# EAGLE design CrawlerProc_ver_00 (EAGLE 5.09)
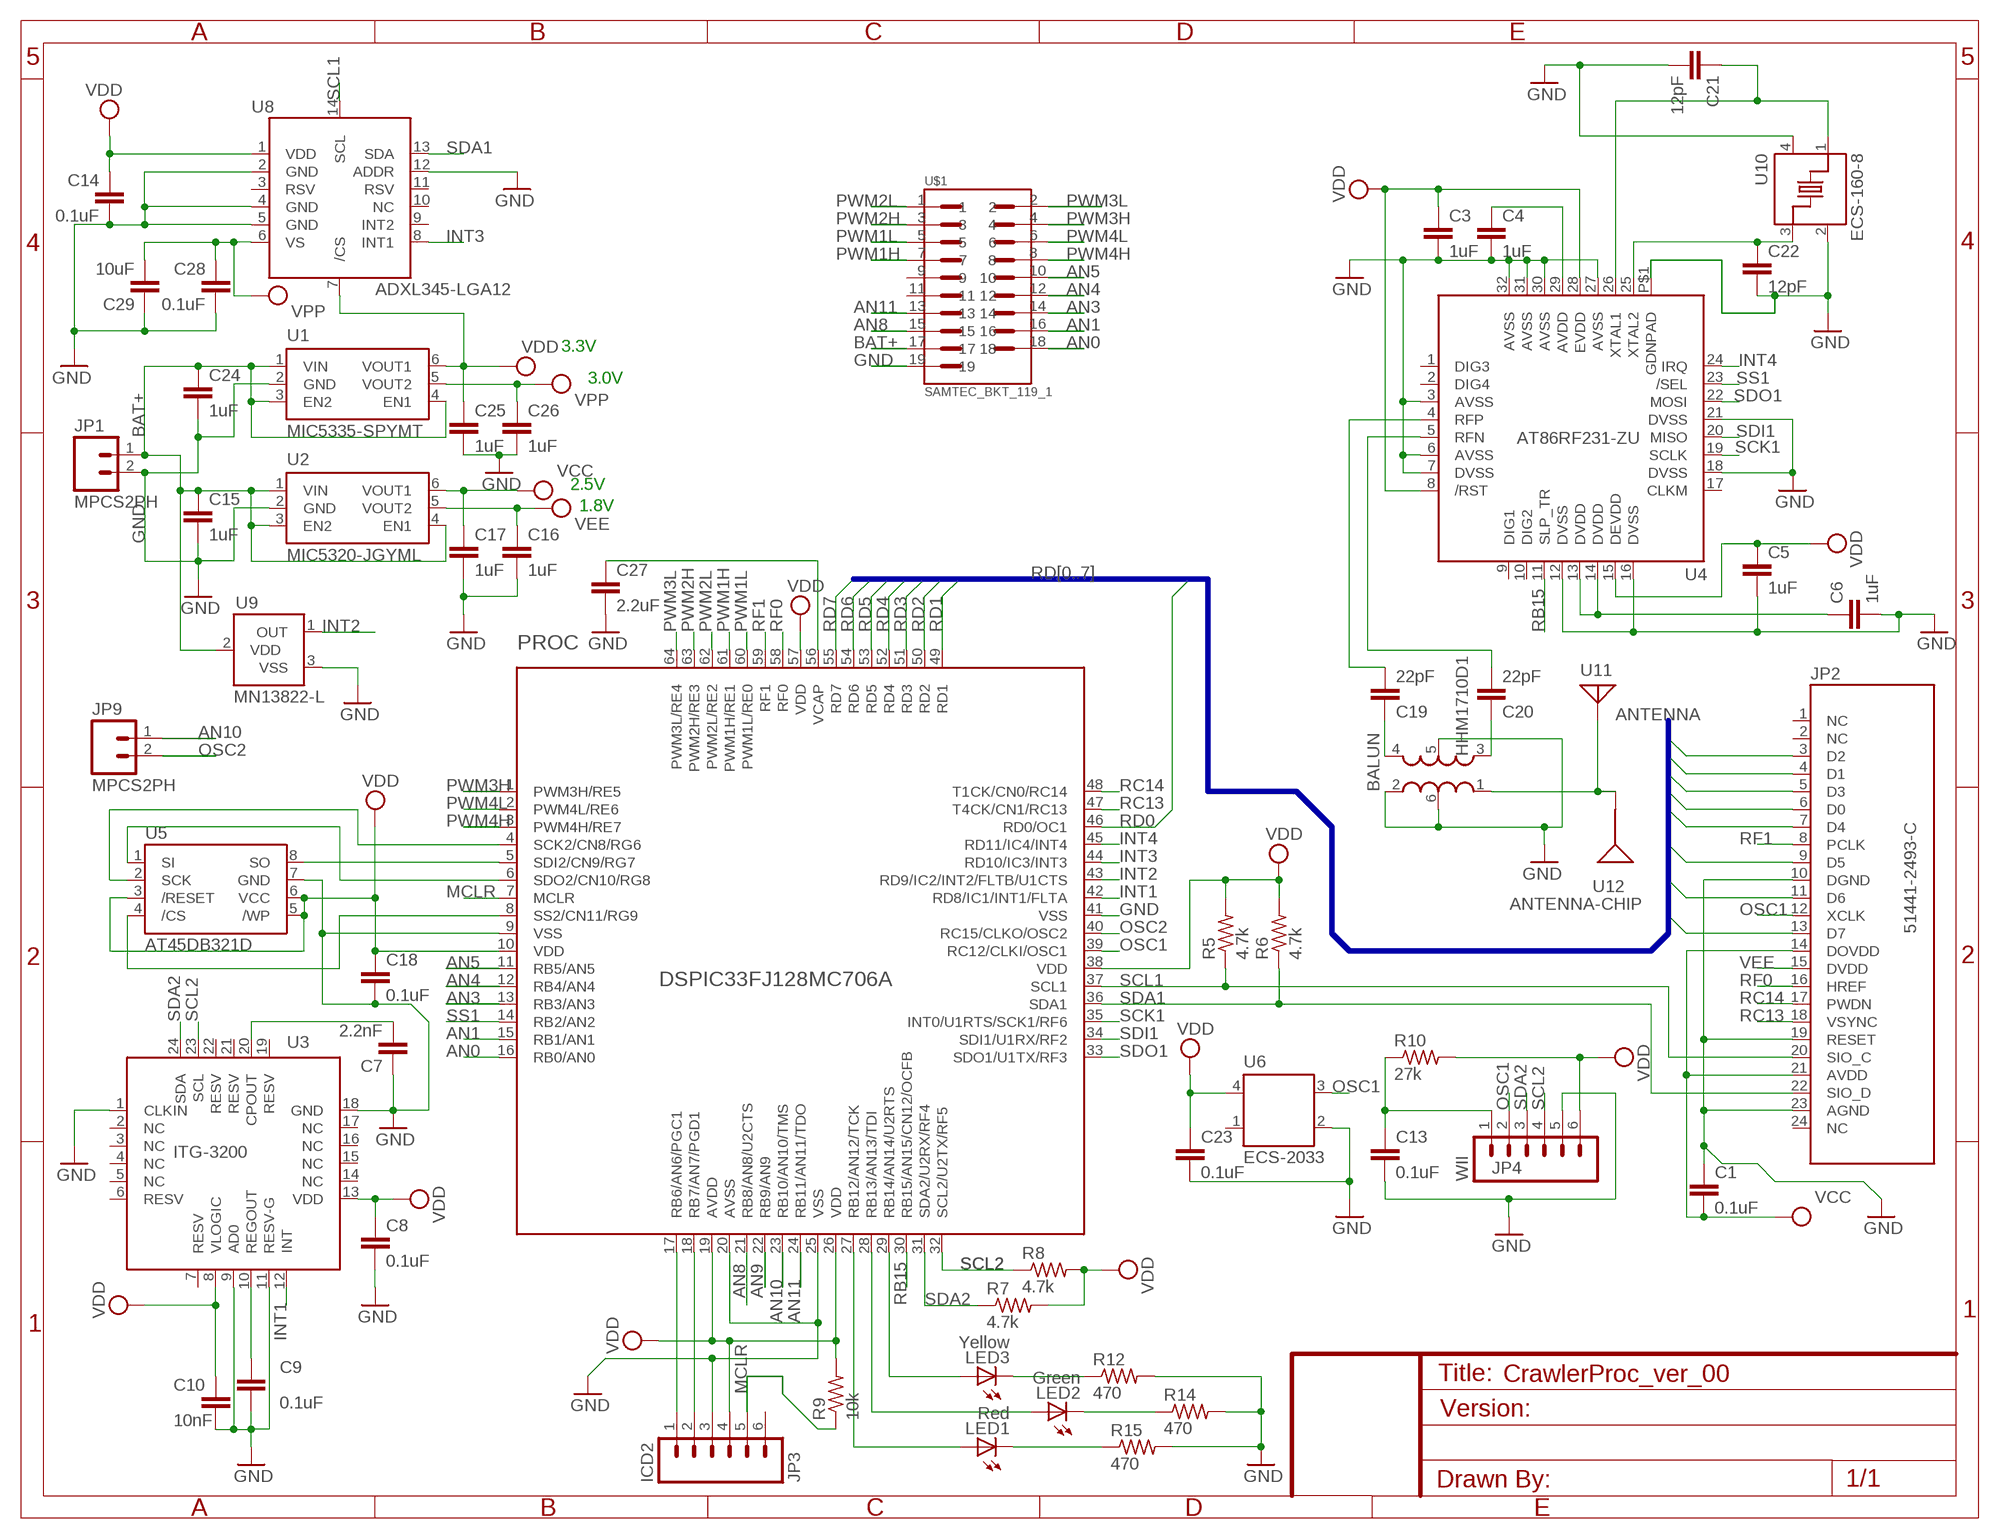
[diagram p0: schematic, sheet 1]

## Parts
BALUN  HHM1710D1  BALUNA  [BALUN]
C1  0.1uF  CAP0402-CAP  [0402-CAP]
C3  1uF  CAP0402-CAP  [0402-CAP]
C4  1uF  CAP0402-CAP  [0402-CAP]
C5  1uF  CAP0402-CAP  [0402-CAP]
C6  1uF  CAP0402-CAP  [0402-CAP]
C7  2.2nF  CAP0402-CAP  [0402-CAP]
C8  0.1uF  CAP0402-CAP  [0402-CAP]
C9  0.1uF  CAP0402-CAP  [0402-CAP]
C10  10nF  CAP0402-CAP  [0402-CAP]
C13  0.1uF  CAP0402-CAP  [0402-CAP]
C14  0.1uF  CAP0402-CAP  [0402-CAP]
C15  1uF  CAP0402-CAP  [0402-CAP]
C16  1uF  CAP0402-CAP  [0402-CAP]
C17  1uF  CAP0402-CAP  [0402-CAP]
C18  0.1uF  CAP0402-CAP  [0402-CAP]
C19  22pF  CAP0402-CAP  [0402-CAP]
C20  22pF  CAP0402-CAP  [0402-CAP]
C21  12pF  CAP0402-CAP  [0402-CAP]
C22  12pF  CAP0402-CAP  [0402-CAP]
C23  0.1uF  CAP0402-CAP  [0402-CAP]
C24  1uF  CAP0402-CAP  [0402-CAP]
C25  1uF  CAP0402-CAP  [0402-CAP]
C26  1uF  CAP0402-CAP  [0402-CAP]
C27  2.2uF  CAP0402-CAP  [0402-CAP]
C28  0.1uF  CAP0402-CAP  [0402-CAP]
C29  10uF  CAP0603-CAP  [0603-CAP]
JP1  MPCS2PH  [MOLEX-PICO_CLASP_S2P]
JP2  51441-2493-C  OV7660FSL_CON-24  [MOLEX-52740-2490]
JP3  ICD2  MPCS6PH  [MOLEX-PICO_CLASP_S6P]
JP4  WII  MPCS6PH  [MOLEX-PICO_CLASP_S6P]
JP9  MPCS2PH  [MOLEX-PICO_CLASP_S2P]
LED1  Red  LEDCHIP-LED0603  [CHIP-LED0603]
LED2  Green  LEDCHIP-LED0603  [CHIP-LED0603]
LED3  Yellow  LEDCHIP-LED0603  [CHIP-LED0603]
PROC  DSPIC33FJ128MC706A  DSPIC33FJ128MC706-I/PT  [TQFP64]
R5  4.7k  R-US_R0402  [R0402]
R6  4.7k  R-US_R0402  [R0402]
R7  4.7k  R-US_R0402  [R0402]
R8  4.7k  R-US_R0402  [R0402]
R9  10k  R-US_R0402  [R0402]
R10  27k  R-US_R0402  [R0402]
R12  470  R-US_R0402  [R0402]
R14  470  R-US_R0402  [R0402]
R15  470  R-US_R0402  [R0402]
U1  MIC5335-SPYMT  MIC5320-JGYML  [MLF-6]
U2  MIC5320-JGYML  [MLF-6]
U3  ITG-3200  ITG-3200-00  [QFN-24]
U4  AT86RF231-ZU  [QFN-32]
U5  AT45DB321D  [MLF(VDFN)-8]
U6  ECS-2033  OSCILLATORS  [OSCILLATOR-SMD]
U8  ADXL345-LGA12  ADXL345  [LGA14]
U9  MN13822-L  VOL_DETECTOR  [SOT-23-3]
U10  ECS-160-8  CRYSTALS  [CRYSTAL-SMD]
U11  ANTENNA  [ANTENNA_PAD]
U12  ANTENNA-CHIP  [ANTENNA-CHIP]
U$1  SAMTEC_BKT_119_1  [SAMTEC_19P_1MM_MICRO_CONN]

## Nets
AN0: PROC.16(RB0/AN0) U$1.18
AN1: PROC.15(RB1/AN1) U$1.16
AN3: PROC.13(RB3/AN3) U$1.14
AN4: PROC.12(RB4/AN4) U$1.12
AN5: PROC.11(RB5/AN5) U$1.10
AN8: PROC.21(RB8/AN8/U2CTS) U$1.15
AN9: PROC.22(RB9/AN9)
AN10: JP9.1 PROC.23(RB10/AN10/TMS)
AN11: PROC.24(RB11/AN11/TDO) U$1.13
BAT+ [sup]: C15.1 C24.1 JP1.1 U1.1(VIN) U1.3(EN2) U1.4(EN1) U2.1(VIN) U2.3(EN2) U2.4(EN1) U9.2(VDD) U$1.17
GND [sup]: BALUN.2(RFGND) BALUN.5(GND) BALUN.6(NC) C1.1 C3.2 C4.2 C5.2 C6.2 C7.1 C8.2 C9.2 C10.2 C13.2 C14.2 C15.2 C16.2 C17.2 C18.2 C21.2 C22.2 C23.2 C24.2 C25.2 C26.2 C27.2 C28.2 C29.1 JP1.2 JP2.10(DGND) JP2.19(RESET) JP2.23(AGND) JP3.3 JP4.5 PROC.9(VSS) PROC.20(AVSS) PROC.25(VSS) PROC.41(VSS) R12.2 R14.2 R15.2 U1.2(GND) U2.2(GND) U3.1(CLKIN) U3.9(AD0) U3.11(RESV-G) U3.18(GND) U4.3(AVSS) U4.6(AVSS) U4.7(DVSS) U4.12(DVSS) U4.16(DVSS) U4.18(DVSS) U4.21(DVSS) U4.27(AVSS) U4.30(AVSS) U4.31(AVSS) U4.32(AVSS) U4.P$1(GDNPAD) U5.7(GND) U6.2(GND) U8.2(GND) U8.4(GND) U8.5(GND) U8.12(ADDR) U9.3(VSS) U10.2(GND) U10.4(GND) U$1.19
INT1: PROC.42(RD8/IC1/INT1/FLTA) U3.12(INT)
INT2: PROC.43(RD9/IC2/INT2/FLTB/U1CTS) U9.1(OUT)
INT3: PROC.44(RD10/IC3/INT3) U8.8(INT1)
INT4: PROC.45(RD11/IC4/INT4) U4.24(IRQ)
MCLR: JP3.5 PROC.7(MCLR) R9.1
N$1: C27.1 PROC.56(VCAP)
N$2: PROC.6(SDO2/CN10/RG8) U5.1(SI)
N$3: LED3.C R12.1
N$6: LED3.A PROC.29(RB14/AN14/U2RTS)
N$7: LED2.C R14.1
N$8: LED1.C R15.1
N$9: LED2.A PROC.28(RB13/AN13/TDI)
N$11: LED1.A PROC.27(RB12/AN12/TCK)
N$21: JP3.1 PROC.17(RB6/AN6/PGC1)
N$23: C4.1 U4.29(AVDD)
N$24: JP3.2 PROC.18(RB7/AN7/PGD1)
N$28: C6.1 U4.13(DVDD) U4.14(DVDD)
N$29: C7.2 U3.20(CPOUT)
N$32: C9.1 U3.10(REGOUT)
N$42: PROC.4(SCK2/CN8/RG6) U5.2(SCK)
N$43: BALUN.4(BAL4) C19.1
N$45: PROC.5(SDI2/CN9/RG7) U5.8(SO)
N$46: BALUN.3(BAL3) C20.1
N$47: C19.2 U4.4(RFP)
N$48: PROC.8(SS2/CN11/RG9) U5.4(/CS)
N$49: C20.2 U4.5(RFN)
N$50: C22.1 U4.25(XTAL2) U10.3(IN/OUT)
N$51: C21.1 U4.26(XTAL1) U10.1(IN/OUT)
N$52: BALUN.1(UNBAL) U11.P$1 U12.SIG(SIGNAL)
N$57: C13.1 JP4.1 R10.1
OSC1: JP2.12(XCLK) JP4.2 PROC.39(RC12/CLKI/OSC1) U6.3(OUT)
OSC2: JP9.2 PROC.40(RC15/CLKO/OSC2)
PWM1H: PROC.61(PWM1H/RE1) U$1.7
PWM1L: PROC.60(PWM1L/RE0) U$1.5
PWM2H: PROC.63(PWM2H/RE3) U$1.3
PWM2L: PROC.62(PWM2L/RE2) U$1.1
PWM3H: PROC.1(PWM3H/RE5) U$1.4
PWM3L: PROC.64(PWM3L/RE4) U$1.2
PWM4H: PROC.3(PWM4H/RE7) U$1.8
PWM4L: PROC.2(PWM4L/RE6) U$1.6
RB15: PROC.30(RB15/AN15/CN12/OCFB) U4.11(SLP_TR)
RC13: JP2.18(VSYNC) PROC.47(T4CK/CN1/RC13)
RC14: JP2.17(PWDN) PROC.48(T1CK/CN0/RC14)
RD0: JP2.6(D0) PROC.46(RD0/OC1)
RD1: JP2.4(D1) PROC.49(RD1)
RD2: JP2.3(D2) PROC.50(RD2)
RD3: JP2.5(D3) PROC.51(RD3)
RD4: JP2.7(D4) PROC.52(RD4)
RD5: JP2.9(D5) PROC.53(RD5)
RD6: JP2.11(D6) PROC.54(RD6)
RD7: JP2.13(D7) PROC.55(RD7)
RF0: JP2.16(HREF) PROC.58(RF0)
RF1: JP2.8(PCLK) PROC.59(RF1)
SCK1: PROC.35(INT0/U1RTS/SCK1/RF6) U4.19(SCLK)
SCL1: JP2.20(SIO_C) PROC.37(SCL1) R5.1 U8.14(SCL)
SCL2: JP4.4 PROC.32(SCL2/U2TX/RF5) R8.1 U3.23(SCL)
SDA1: JP2.22(SIO_D) PROC.36(SDA1) R6.1 U8.13(SDA)
SDA2: JP4.3 PROC.31(SDA2/U2RX/RF4) R7.1 U3.24(SDA)
SDI1: PROC.34(SDI1/U1RX/RF2) U4.20(MISO)
SDO1: PROC.33(SDO1/U1TX/RF3) U4.22(MOSI)
SS1: PROC.14(RB2/AN2) U4.23(/SEL)
VCC: C1.2 C17.1 JP2.14(DOVDD) JP2.21(AVDD) U2.6(VOUT1)
VDD: C3.1 C5.1 C8.1 C10.1 C14.1 C18.1 C23.1 C25.1 JP3.4 JP4.6 PROC.10(VDD) PROC.19(AVDD) PROC.26(VDD) PROC.38(VDD) PROC.57(VDD) R5.2 R6.2 R7.2 R8.2 R9.2 R10.2 U1.6(VOUT1) U3.8(VLOGIC) U3.13(VDD) U4.8(/RST) U4.15(DEVDD) U4.28(EVDD) U5.3(/RESET) U5.5(/WP) U5.6(VCC) U6.4(VDD) U8.1(VDD) U8.7(/CS)
VEE: C16.1 JP2.15(DVDD) U2.5(VOUT2)
VPP: C26.1 C28.1 C29.2 U1.5(VOUT2) U8.6(VS)
Unconnected: JP2.1(NC) JP2.2(NC) JP2.24(NC) JP3.6 U3.2(NC) U3.3(NC) U3.4(NC) U3.5(NC) U3.6(RESV) U3.7(RESV) U3.14(NC) U3.15(NC) U3.16(NC) U3.17(NC) U3.19(RESV) U3.21(RESV) U3.22(RESV) U4.1(DIG3) U4.2(DIG4) U4.9(DIG1) U4.10(DIG2) U4.17(CLKM) U6.1(NC) U8.3(RSV) U8.9(INT2) U8.10(NC) U8.11(RSV) U$1.9 U$1.11

## Buses
RD[0..7]

## Notes on the sheet
- 3.3V
- 3.0V
- 2.5V
- 1.8V

## Library data of the parts
BALUN = stan:BALUN
C1 C3-C10 C13-C29 = SparkFun:CAP: Capacitor Standard 0603 ceramic capacitor, and 0.1" leaded capacitor.
JP1 JP9 = stan:MPCS2P: Molex Pico-Clasp Single Row 2 POS
JP2 = stan:OV7660FSL_CON
JP3 JP4 = stan:MPCS6P: Molex Pico-Clasp Single Row 6 Pos
LED1-LED3 = led:LED: LED OSRAM: - CHIPLED LG R971, LG N971, LY N971, LG Q971, LY Q971, LO R971, LY R971 LH N974, LH R974 LS Q976, LO Q976, LY Q976 LO Q996 - Hyper CHIPLED LW Q18S LB Q993, LB Q99A, LB R99A - SideLED LS A670, LO A670, LY A670, LG A670, LP A670 LB A673, LV A673, LT A673, LW A673 LH A674 LY A675 LS A676, LA A676, LO A676, LY A676, LW A676 LS A679, LY A679, LG A679 - Hyper Micro SIDELED® LS Y876, LA Y876, LO Y876, LY Y876 LT Y87S - SmartLED LW L88C, LW L88S LB L89C, LB L89S, LG L890 LS L89K, LO L89K, LY L89K LS L896, LA L896, LO L896, LY L896 - TOPLED LS T670, LO T670, LY T670, LG T670, LP T670 LSG T670, LSP T670, LSY T670, LOP T670, LYG T670 LG T671, LOG T671, LSG T671 LB T673, LV T673, LT T673, LW T673 LH T674 LS T676, LA T676, LO T676, LY T676, LB T676, LH T676, LSB T676, LW T676 LB T67C, LV T67C, LT T67C, LS T67K, LO T67K, LY T67K, LW E67C LS E67B, LA E67B, LO E67B, LY E67B, LB E67C, LV E67C, LT E67C LW T67C LS T679, LY T679, LG T679 LS T770, LO T770, LY T770, LG T770, LP T770 LB T773, LV T773, LT T773, LW T773 LH T774 LS E675, LA E675, LY E675, LS T675 LS T776, LA T776, LO T776, LY T776, LB T776 LHGB T686 LT T68C, LB T68C - Hyper Mini TOPLED® LB M676 - Mini TOPLED Santana® LG M470 LS M47K, LO M47K, LY M47K Source: http://www.osram.convergy.de LUXEON: - LUMILED® LXK2-PW12-R00, LXK2-PW12-S00, LXK2-PW14-U00, LXK2-PW14-V00 LXK2-PM12-R00, LXK2-PM12-S00, LXK2-PM14-U00 LXK2-PE12-Q00, LXK2-PE12-R00, LXK2-PE12-S00, LXK2-PE14-T00, LXK2-PE14-U00 LXK2-PB12-K00, LXK2-PB12-L00, LXK2-PB12-M00, LXK2-PB14-N00, LXK2-PB14-P00, LXK2-PB14-Q00 LXK2-PR12-L00, LXK2-PR12-M00, LXK2-PR14-Q00, LXK2-PR14-R00 LXK2-PD12-Q00, LXK2-PD12-R00, LXK2-PD12-S00 LXK2-PH12-R00, LXK2-PH12-S00 LXK2-PL12-P00, LXK2-PL12-Q00, LXK2-PL12-R00 Source: www.luxeon.com KINGBRIGHT: KA-3528ASYC Source: www.kingbright.com
PROC = stan:DSPIC33FJ128MC706: Microchip dsPIC33FJ128MC706
R5-R10 R12 R14 R15 = rcl:R-US_: RESISTOR, American symbol
U1 U2 = stan:MIC5320: MIC5320 High Performance Dual 150mA Voltage Regulator Package: NOT VERIFIED
U3 = stan:ITG-3200: Invensense 3-axis Gyroscope Package: NOT VERIFIED YET
U4 = stan:AT86RF231: Atmel 2.4GHz transceiver for Zigbee
U5 = stan:AT45DB: Atmel DataFlash AT45DB Series Package: NOT VERIFIED
U6 = stan:OSCILLATOR
U8 = stan:ADXL345
U9 = stan:VOL_DETECTOR
U10 = stan:CRYSTAL
U11 = stan:ANTENNA
U12 = stan:ANTENNA-CHIP
U$1 = AMH:SAMTEC_BKT_119_1

## Net classes
1 sup: width 0.254 mm

## Board
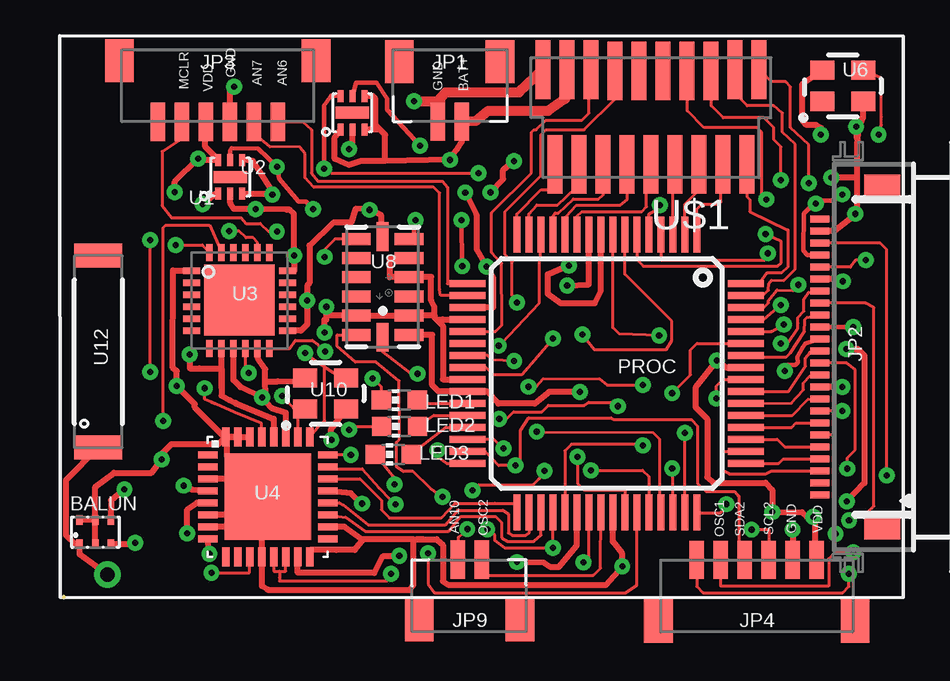
[diagram p1: board, top side]
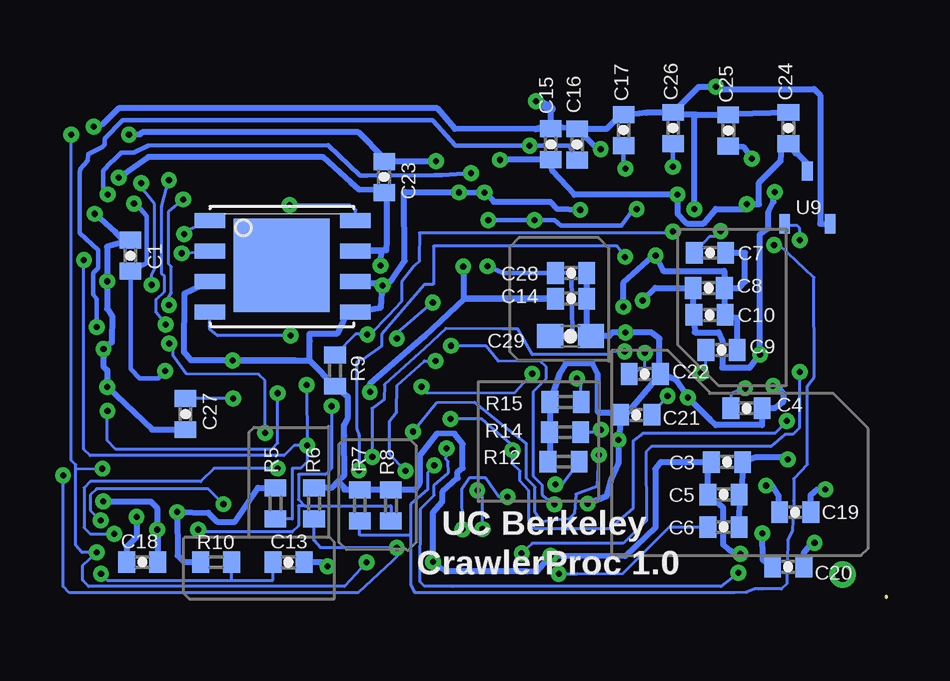
[diagram p2: board, bottom side, seen from below]

Size 0.01 x 0.06 mm. Coordinates in mm from the lower left corner, seen from the top.
Outline: 0.01,0.01 0,0.01
Outline: 0,0.01 0,0
Outline: 0,0.01 0,0.06
Copper layers (1*16): Top 0.035mm / dielectric 1.5mm / Bottom 0.035mm
Design rules "default *": minimum track width 5mil, minimum drill 10mil, track to track 5mil, track to pad 5mil, pad to pad 5mil, via to via 5mil, smd to smd 5mil, copper to edge 5mil, drill to drill 5mil, minimum pad ring 10mil, minimum via ring 8mil, stop-mask expansion 4mil, vias tented up to drill 27mil, thermal gap 10mil

### Footprints (pad centres in the part's own frame; a part is rotated, then mirrored left to right if it is on the bottom)
BALUN = smd 0.27 x 0.4: 1 -0.7,-0.5; 2 -0.05,-0.5; 3 0.6,-0.5; 4 0.6,0.5; 5 -0.05,0.5; 6 -0.7,0.5
0402-CAP = smd 0.7 x 0.9: 1 -0.65,0; 2 0.65,0
0603-CAP = smd 1.1 x 1: 1 -0.85,0; 2 0.85,0
MOLEX-PICO_CLASP_S2P = smd 0.6 x 1.6: 1 -0.5,1; 2 0.5,1 | smd 1.2 x 1.8: A -2.1,-1.5; B 2.1,-1.5
MOLEX-52740-2490 = smd 0.3 x 0.8: 1 -5.75,2.5; 2 -5.25,2.5; 3 -4.75,2.5; 4 -4.25,2.5; 5 -3.75,2.5; 6 -3.25,2.5; 7 -2.75,2.5; 8 -2.25,2.5; 9 -1.75,2.5; 10 -1.25,2.5; 11 -0.75,2.5; 12 -0.25,2.5; 13 0.25,2.5; 14 0.75,2.5; 15 1.25,2.5; 16 1.75,2.5; 17 2.25,2.5; 18 2.75,2.5; 19 3.25,2.5; 20 3.75,2.5; 21 4.25,2.5; 22 4.75,2.5; 23 5.25,2.5; 24 5.75,2.5 | smd 0.85 x 1.5: P$1 -7.18,-0.1; P$2 7.18,-0.1
MOLEX-PICO_CLASP_S6P = smd 0.6 x 1.6: 1 -2.5,1; 2 -1.5,1; 3 -0.5,1; 4 0.5,1; 5 1.5,1; 6 2.5,1 | smd 1.2 x 1.8: A -4.1,-1.55; B 4.1,-1.55
CHIP-LED0603 = smd 0.8 x 0.8: A 0,-0.75; C 0,0.75
TQFP64 = smd 1.5 x 0.28: 1 -5.8,3.75; 2 -5.8,3.25; 3 -5.8,2.75; 4 -5.8,2.25; 5 -5.8,1.75; 6 -5.8,1.25; 7 -5.8,0.75; 8 -5.8,0.25; 9 -5.8,-0.25; 10 -5.8,-0.75; 11 -5.8,-1.25; 12 -5.8,-1.75; 13 -5.8,-2.25; 14 -5.8,-2.75; 15 -5.8,-3.25; 16 -5.8,-3.75; 33 5.8,-3.75; 34 5.8,-3.25; 35 5.8,-2.75; 36 5.8,-2.25; 37 5.8,-1.75; 38 5.8,-1.25; 39 5.8,-0.75; 40 5.8,-0.25; 41 5.8,0.25; 42 5.8,0.75; 43 5.8,1.25; 44 5.8,1.75; 45 5.8,2.25; 46 5.8,2.75; 47 5.8,3.25; 48 5.8,3.75 | smd 0.28 x 1.5: 17 -3.75,-5.8; 18 -3.25,-5.8; 19 -2.75,-5.8; 20 -2.25,-5.8; 21 -1.75,-5.8; 22 -1.25,-5.8; 23 -0.75,-5.8; 24 -0.25,-5.8; 25 0.25,-5.8; 26 0.75,-5.8; 27 1.25,-5.8; 28 1.75,-5.8; 29 2.25,-5.8; 30 2.75,-5.8; 31 3.25,-5.8; 32 3.75,-5.8; 49 3.75,5.8; 50 3.25,5.8; 51 2.75,5.8; 52 2.25,5.8; 53 1.75,5.8; 54 1.25,5.8; 55 0.75,5.8; 56 0.25,5.8; 57 -0.25,5.8; 58 -0.75,5.8; 59 -1.25,5.8; 60 -1.75,5.8; 61 -2.25,5.8; 62 -2.75,5.8; 63 -3.25,5.8; 64 -3.75,5.8
R0402 = smd 0.7 x 0.9: 1 -0.65,0; 2 0.65,0
MLF-6 = smd 0.25 x 0.5: 1 -0.5,-0.7; 2 0,-0.7; 3 0.5,-0.7; 4 0.5,0.7; 5 0,0.7; 6 -0.5,0.7 | smd 1.4 x 0.5: P$1 0,0
QFN-24 = smd 0.7 x 0.275: 1 -2,1.25; 2 -2,0.75; 3 -2,0.25; 4 -2,-0.25; 5 -2,-0.75; 6 -2,-1.25; 13 2,-1.25; 14 2,-0.75; 15 2,-0.25; 16 2,0.25; 17 2,0.75; 18 2,1.25 | smd 0.275 x 0.7: 7 -1.25,-2; 8 -0.75,-2; 9 -0.25,-2; 10 0.25,-2; 11 0.75,-2; 12 1.25,-2; 19 1.25,2; 20 0.75,2; 21 0.25,2; 22 -0.25,2; 23 -0.75,2; 24 -1.25,2 | smd 2.95 x 2.95: 25 -0.01,0.03
QFN-32 = smd 0.8 x 0.3: 1 -2.5,1.75; 2 -2.5,1.25; 3 -2.5,0.75; 4 -2.5,0.25; 5 -2.5,-0.25; 6 -2.5,-0.75; 7 -2.5,-1.25; 8 -2.5,-1.75; 17 2.5,-1.75; 18 2.5,-1.25; 19 2.5,-0.75; 20 2.5,-0.25; 21 2.5,0.25; 22 2.5,0.75; 23 2.5,1.25; 24 2.5,1.75 | smd 0.3 x 0.8: 9 -1.75,-2.5; 10 -1.25,-2.5; 11 -0.75,-2.5; 12 -0.25,-2.5; 13 0.25,-2.5; 14 0.75,-2.5; 15 1.25,-2.5; 16 1.75,-2.5; 25 1.75,2.5; 26 1.25,2.5; 27 0.75,2.5; 28 0.25,2.5; 29 -0.25,2.5; 30 -0.75,2.5; 31 -1.25,2.5; 32 -1.75,2.5 | smd 3.6 x 3.6: P$1 0,0.001
MLF(VDFN)-8 = smd 1.27 x 0.635: 1 0,4.31; 2 0,3.04; 3 0,1.77; 4 0,0.5; 5 6.05,0.5; 6 6.05,1.77; 7 6.05,3.04; 8 6.05,4.31 | smd 4 x 3.9: P$1 2.991,2.44
OSCILLATOR-SMD = smd 1 x 0.8: 1 -0.85,-0.65; 2 0.85,-0.65; 3 0.85,0.65; 4 -0.85,0.65
LGA14 = smd 0.5 x 1.2: 1 2,1.1; 2 1.2,1.1; 3 0.4,1.1; 4 -0.4,1.1; 5 -1.2,1.1; 6 -2,1.1; 8 -2,-1.1; 9 -1.2,-1.1; 10 -0.4,-1.1; 11 0.4,-1.1; 12 1.2,-1.1; 13 2,-1.1 | smd 1.2 x 0.5: 7 -2.1,0; 14 2.1,0
SOT-23-3 = smd 0.45 x 0.8: 1 0.2,0.4; 2 1.15,2.6; 3 2.1,0.4
CRYSTAL-SMD = smd 1 x 0.8: 1 -0.85,-0.65; 2 0.85,-0.65; 3 0.85,0.65; 4 -0.85,0.65
ANTENNA_PAD = drill 0.6 round: P$1 0,0
ANTENNA-CHIP = smd 1 x 2: NC 4,0; SIG -4,0
SAMTEC_19P_1MM_MICRO_CONN = smd 0.61 x 2.44: 1 -4,-2; 2 -3.5,1.955; 3 -3,-2; 4 -2.5,1.955; 5 -2,-1.955; 6 -1.5,1.955; 7 -1,-1.955; 8 -0.5,1.955; 9 0,-1.955; 10 0.5,1.955; 11 1,-1.955; 12 1.5,1.955; 13 2,-1.955; 14 2.5,1.955; 15 3,-2; 16 3.5,1.955; 17 4,-2; 18 4.5,1.955; 19 5,-2

### Placement (x,y rotation side)
BALUN  1.37,2.74 0 top
C1  31.5,14.27 270 bottom  (outside the outline)
C3  6.63,5.66 0 bottom  (outside the outline)
C4  5.82,7.9 0 bottom  (outside the outline)
C5  6.78,4.31 0 bottom  (outside the outline)
C6  6.78,2.95 0 bottom  (outside the outline)
C7  7.34,14.38 180 bottom  (outside the outline)
C8  7.4,12.92 0 bottom  (outside the outline)
C9  6.86,10.33 0 bottom  (outside the outline)
C10  7.36,11.79 0 bottom  (outside the outline)
C13  24.91,1.48 0 bottom  (outside the outline)
C14  13.13,12.47 0 bottom  (outside the outline)
C15  13.98,18.91 90 bottom  (outside the outline)
C16  12.88,18.9 90 bottom  (outside the outline)
C17  10.94,19.5 90 bottom  (outside the outline)
C18  31.01,1.49 0 bottom  (outside the outline)
C19  3.79,3.57 180 bottom  (outside the outline)
C20  4.08,1.29 180 bottom  (outside the outline)
C21  10.42,7.63 180 bottom  (outside the outline)
C22  10.06,9.33 0 bottom  (outside the outline)
C23  20.93,17.54 270 bottom  (outside the outline)
C24  4.08,19.59 90 bottom  (outside the outline)
C25  6.58,19.48 90 bottom  (outside the outline)
C26  8.88,19.59 90 bottom  (outside the outline)
C27  29.21,7.66 270 bottom  (outside the outline)
C28  13.13,13.54 0 bottom  (outside the outline)
C29  13.16,10.91 180 bottom  (outside the outline)
JP1  16.09,20.85 180 top  (outside the outline)
JP2  34.02,10.04 90 top  (outside the outline)
JP3  6.43,20.85 180 top  (outside the outline)
JP4  28.89,0.58 0 top  (outside the outline)
JP9  16.93,0.59 0 top  (outside the outline)
LED1  13.99,8.24 90 top  (outside the outline)
LED2  14,7.14 90 top  (outside the outline)
LED3  13.74,5.98 90 top  (outside the outline)
PROC  22.65,9.35 270 top  (outside the outline)
R5  25.46,3.94 90 bottom  (outside the outline)
R6  23.85,3.94 90 bottom  (outside the outline)
R7  21.94,3.85 90 bottom  (outside the outline)
R8  20.64,3.85 90 bottom  (outside the outline)
R9  22.97,9.47 270 bottom  (outside the outline)
R10  27.93,1.49 180 bottom  (outside the outline)
R12  13.45,5.67 180 bottom  (outside the outline)
R14  13.38,6.9 180 bottom  (outside the outline)
R15  13.37,8.16 180 bottom  (outside the outline)
U1  6.94,17.54 0 top  (outside the outline)
U2  12.03,20.22 0 top  (outside the outline)
U3  7.33,12.39 0 top  (outside the outline)
U4  8.51,4.21 0 top  (outside the outline)
U5  28.18,11.42 0 bottom  (outside the outline)
U6  32.48,21.34 0 top  (outside the outline)
U8  13.3,12.97 270 top  (outside the outline)
U9  4.44,15.19 0 bottom  (outside the outline)
U10  10.92,8.52 0 top  (outside the outline)
U11  1.82,0.97 0 top
U12  1.45,10.26 90 top  (outside the outline)
U$1  24.98,20.02 180 top  (outside the outline)

### Tracks (layer width: path | path; a pad name or v marks a point on that pad's centre or on a via)
AN0
  Top 0.127: PROC.16 18.9,16.01 19.9,17.01 20.3,17.01 20.3,17.88 U$1.18
AN1
  Top 0.127: PROC.15 19.4,16.01 19.73,16.38 20.59,16.38 21.36,17.11 21.4,17.98 U$1.16
AN3
  Top 0.127: PROC.13 20.4,15.91 20.49,16.05 20.62,16.05 21.25,16.63 22.3,16.63 22.5,16.81 22.5,18.05 U$1.14
AN4
  Top 0.127: PROC.12 20.96,15.91 21.37,16.37 23.21,16.37 23.5,16.61 23.5,18.05 U$1.12
AN5
  Top 0.127: PROC.11 21.4,15.91 21.6,16.1 24.1,16.1 24.3,16.31 24.3,17.88 U$1.10
AN8
  Top 0.127: PROC.21 18,11.1 18.27,11.37 18.26,13.94 17.84,14.4 17.84,16.06 19.5,17.71 19.5,19.41 19.6,19.51 19.7,19.51 20.1,19.91 21.6,19.91 21.9,20.21 21.9,21.94 U$1.15
AN10  (via drill 0.25 pad 0.66)
  Top 0.127: PROC.23 17.64,10.12 17.86,9.92 v18.78,9.87 | v20.04,5.29 19.81,4.96 19.56,4.71 17.3,4.71 v17.04,4.48 | JP9.1 16.44,2.02 16.44,2.1 16.45,2.25 16.45,2.52 v16.83,2.86
  Bottom 0.127: v18.78,9.87 19.25,9.88 20.4,8.84 20.41,7.74 20.7,7.38 20.7,5.98 v20.04,5.29 | v16.83,2.86 16.83,4.14 16.84,4.35 v17.04,4.48
AN11  (via drill 0.25)
  Top 0.127: PROC.24 17.49,9.6 17.5,9.61 17.6,9.61 17.9,9.31 19.1,9.31 v20.4,10.81 | v18.9,12.31 18.9,12.41 18.7,12.61 18.7,14.01 18.4,14.31 18.4,16.11 19.9,17.61 19.9,19.31 20.1,19.51 21.7,19.51 23,20.81 23,21.96 U$1.13
  Bottom 0.127: v20.4,10.81 20.4,11.01 v18.9,12.31
BAT+  (via drill 0.25)
  Top 0.254: JP1.1 16.6,19.01 16.41,18.72 16.2,18.47 v16.1,18.26 13.4,18.21 | U2.1 11.3,19.19 11.3,18.31 11.9,18.05 12.4,18.21 13.4,18.21 | U2.4 12.89,20.92 13,20.81 13,19.71 13.19,19.52 | 13.19,19.52 U2.3 | 13.19,19.52 13.4,19.31 13.4,18.21 | U1.4 7.5,18.27 7.9,18.21 8.77,16.84 | U1.3 8.77,16.84 | 8.77,16.84 v8.7,16.81 | U1.1 6.33,16.84 v5.8,16.41
  Top 0.406: JP1.1 17.18,19.89 17.7,20.31 20.2,20.31 20.9,20.81 20.9,21.94 U$1.17
  Bottom 0.254: U9.2 3.29,18.09 3.67,18.51 3.77,18.54 C24.1 4.37,18.84 4.4,18.21 5.3,17.31 5.3,16.41 v5.8,16.41 5.8,16.21 7.1,16.21 7.6,15.61 8.3,15.61 8.7,16.01 v8.7,16.81 13,16.81 13.9,17.78 C15.1 13.95,18.26 v16.1,18.26
GND  (via drill 0.25, 0.25 pad 0.66)
  Top 0.254: BALUN.2 BALUN.5 | BALUN.5 BALUN.6 | v33.04,19.65 33.03,19.54 33.07,19.14 33.12,19.54 | 33.12,19.54 33.07,18.92 33.07,17.51 | 33.07,17.51 33.07,16.31 | 33.07,16.31 33.07,16.03 32.13,15.29 JP2.23 | 14.58,2.44 14.58,0.53 14.43,0.34 8.5,0.34 8.53,0.35 8.26,0.49 8.26,1.54 | 14.58,2.44 15,2.44 14.71,2.44 15.55,2.44 15.56,2.42 15.81,2.2 15.8,0.69 16.05,0.53 22.6,0.53 v23.29,1.32 23.29,1.85 22.9,2.34 PROC.41 | U3.1 4.57,13.65 4.55,9.59 4.71,9.46 v4.71,8.83 5.46,8.08 | PROC.25 15.81,9.1 15.81,11.34 15.55,11.6 | v32.63,10.38 33.1,10.38 33.38,10.1 33.38,4.79 v32.64,4.01 | 13.29,2.44 12.49,2.44 12.13,1.99 11.36,2 10.28,2 U4.16 | 5.46,8.08 | U4.31 6.7,6.71 5.46,7.94 5.46,8.08 | v8.27,8.36 8.33,8.42 8.42,8.52 8.41,9.03 | v8.27,8.36 7.37,8.79 7.08,9.07 | 7.08,9.07 | 7.08,9.07 U3.9 | U4.32 U4.31 | v32.48,13.2 32.31,13.28 32.05,13.29 JP2.19 | U4.32 6.76,6.46 | U4.32 | 15.46,11.78 15.46,12.13 15.31,12.4 15.31,13.38 U8.4 13.6,13.37 13.6,14.17 U8.5 | 15.46,11.78 15.46,11.69 15.55,11.6 | U3.18 9.61,13.63 v9.61,14.27 9.6,16.01 9.43,16.18 9.3,16.18 v8,16.21 7.1,16.21 6.94,16.47 U1.2 | U4.31 7.66,6.71 U4.30 | 15.46,11.78 14.9,11.78 14.45,11.82 U8.2 U8.12 12.21,11.79 11.02,11.79 v10.95,12.13 10.95,11.59 10.87,11.59 v10.87,11.06 | 8.41,9.03 8.93,9.03 9.68,9.04 U10.4 | 13.29,2.44 12.41,2.44 11.7,2.96 11.68,2.96 U4.18 | v8.27,8.36 8.67,7.92 9.26,7.72 U4.27 | v11.16,6.59 11.15,7.04 11.31,7.26 U10.2 | 8.41,9.03 8.41,9.52 8.41,9.53 8.09,10 U3.11 | 8.26,1.54 U4.12 | v30.39,2.84 JP4.5 | 15.55,11.6 15.8,11.6 PROC.20 | v32.47,8.79 32.38,8.79 JP2.10 | v12.44,3.92 11.97,4.36 U4.21 | 14.58,2.44 14.2,2.44 13.81,2.44 13.29,2.44
  Top 0.254: v21.07,13.85 20.26,13.5 20.17,13.48 20.17,12.68 20.71,12.28 22.14,12.28 22.4,12.8 PROC.9 | U4.31 7.27,6.88 7.26,6.88 | 7.26,6.88 | 7.26,6.88 U4.31 | 33.07,16.31 v33,16.01 | U4.P$1 8.5,4.21 7.4,5.31 | 7.4,5.31 6.8,5.91 6.8,6.67 U4.32 | U4.3 7.05,4.96 7.4,5.31 | U4.7 7.55,2.96 7.6,3.01 7.6,3.3 7.76,3.46 | 7.76,3.46 U4.6 | U4.P$1 7.76,3.46 | 8.26,1.54 8.26,3.96 U4.P$1 | U6.2 33.33,20.05 33.12,19.54 | v32,17.52 33.06,17.52 33.07,17.51 | U2.2 12.04,18.98 v11.9,18.71 | JP3.3 6.93,21.14 v7.1,21.31 | U4.32 6.46,6.41 4.5,6.41 4.09,6 v4.09,5.78 3.66,5.21 2.1,5.21 1.32,4.63 BALUN.5
  Top 0.406: 15.59,20.7 JP1.2 | 15.59,20.7 15.91,21.08 18.98,21.08 U$1.19 | v14.6,20.71 15.7,20.71 15.59,20.7
  Bottom 0.254: 6.13,4.35 6.16,4.35 | 6.13,4.35 C5.2 6.04,4.27 C3.2 5.42,5.86 4.36,5.86 v4.09,5.78 | 12.01,7.73 12.02,9.32 12.25,9.77 13.36,9.77 13.62,9.35 R15.2 14.02,6.99 R14.2 14,5.79 13.9,5.79 R12.2 | 12.01,7.73 11.52,7.72 C21.2 11.07,7.24 v11.16,6.59 11.16,5.6 11.47,4.91 11.65,4.23 v12.44,3.92 | 14.2,19.66 14.61,19.54 | 14.61,19.54 17.98,19.55 18.7,20.41 32,20.41 32.66,19.75 32.85,19.65 v33.04,19.65 | U9.3 2.75,15.59 2.75,20.96 3,21.21 7,21.21 v7.1,21.31 7.81,21.31 C26.2 | C27.2 30.6,7.01 v32.47,8.79 32.47,9.48 32.63,9.64 v32.63,10.38 32.27,10.66 32.27,11.76 32.32,11.83 32.48,12.05 v32.48,13.2 32.48,14.64 C1.1 31.8,14.92 32.13,15.25 v33,16.01 | C22.2 9.53,9.27 9.45,9.35 9.45,10.81 9.79,11.06 v10.87,11.06 11.4,11.06 11.56,10.91 C29.1 12.44,10.91 12.48,10.95 C14.2 12.48,13.35 12.43,13.38 C28.2 | C8.2 6.75,13.63 9.29,13.63 v9.61,14.27 9.75,14.22 10.95,13.15 v10.95,12.13 | 6.13,4.35 C6.2 | C22.2 8.74,9.08 8.34,8.52 8.14,8.49 8.1,8.49 v8.27,8.36 7.37,7.46 | 30.65,4.01 30.39,3.75 v30.39,2.84 30.36,2.82 | 30.65,4.01 | v32.64,4.01 30.65,4.01 | C22.2 10.81,7.69 12.01,7.73 | 7.37,7.46 7.11,7.2 5.17,7.2 C4.2 4.65,7.9 4.29,8.16 4.29,8.49 4.52,8.82 v4.71,8.83 | 7.37,7.46 | C9.2 6.21,11.67 C10.2 6.72,11.69 6.75,11.72 C8.2 | v32,17.52 30.74,18.39 23.5,18.39 22.31,17.32 21.97,17.03 21.3,17.04 C23.2 20.85,16.75 20.82,16.39 20.82,14.87 | 20.82,14.87 20.84,14.48 22.16,14.48 U5.7 21.06,14.48 21.07,14.05 v21.07,13.85 | 20.82,14.87 | C8.2 6.15,12.92 5.89,13.18 5.89,14.38 C7.1 | 30.36,2.82 | 30.36,2.82 C18.2 | C26.2 10,20.22 10.3,20.19 C17.2 11.1,20.11 11.66,19.55 C16.2 | v23.29,1.32 23.52,1.47 C13.2
  Bottom 0.254: 13.98,20.39 C15.2 14.2,19.66 | 14.2,19.66 13,19.56 C16.2 | 14.2,19.66 14.28,19.56 14.61,19.54 | v11.9,18.71 12.1,18.77 C16.2 | 7.77,20.13 C25.2 | 7.77,20.13 C24.2 | 7.9,20.13 7.77,20.13 | 7.9,20.13 8.78,20.13 C26.2 | v8,16.21 8,20.03 7.9,20.13
  Bottom 0.406: 13.98,20.39 v14.6,20.71
INT1  (via drill 0.25 pad 0.66)
  Top 0.127: v21.42,5.88 21.42,4.76 21.68,4.5 23.4,4.5 PROC.42 | v10.9,10.27 10.59,10.57 10.36,10.73 9.65,10.73 9.41,10.39 U3.12
  Bottom 0.127: v10.9,10.27 11.46,10.25 11.59,10.15 14.75,10.14 15.36,11.22 15.99,11.22 18.36,11.23 19.24,10.4 20.92,8.89 20.93,8.28 21.43,7.89 v21.42,5.88
INT2  (via drill 0.25, 0.25 pad 0.66)
  Top 0.127: v15.19,1.85 15.19,0.59 15.47,0.2 23.42,0.2 23.9,0.51 PROC.43 | v3.6,9.41 v3.6,14.91
  Bottom 0.127: v15.19,1.85 14.75,2.27 13.61,2.27 10.96,2.28 10,3.21 10.01,6.08 9.78,6.31 4.81,6.31 4.22,6.82 3.88,6.81 3.6,7.1 3.6,7.83 3.6,7.91 v3.6,9.41 | v3.6,14.91 3.6,15.41 3.7,15.51 4.16,15.51 U9.1
INT3  (via drill 0.25 pad 0.66)
  Top 0.127: v21.98,5.31 24.13,5.31 24.4,5.05 PROC.44 | v10.88,14.21 10.88,14.53 11.31,14.96 U8.8
  Bottom 0.127: v10.88,14.21 11.22,14.65 18.87,14.66 18.87,13.06 19.23,13.06 21.03,10.97 21.03,10.5 21.83,9.94 21.91,9.95 22.07,9.82 22.07,7.05 21.98,6.77 v21.98,5.31
INT4  (via drill 0.25 pad 0.66)
  Top 0.127: v11.97,5.96 11.56,5.96 U4.24 | v19.72,6.92 24.57,6.89 24.84,6.62 24.84,3.55 PROC.45
  Bottom 0.127: v19.72,6.92 18.74,8.13 17.14,8.15 15.99,7.21 15,6.44 14.99,4.99 14.63,4.62 14.63,3.55 14.36,3.17 13.53,3.27 13.23,3.28 13,3.51 13,3.53 12.94,4.32 12.04,4.63 v11.97,5.96
MCLR  (via drill 0.25 pad 0.66)
  Top 0.127: v21.63,10.98 22.12,10.35 25.12,10.35 25.36,10.73 25.36,11.53 23.4,13.49 PROC.7 | 4.93,19.44 JP3.5 4.93,19.14 4.1,18.61 4.1,16.36 4.5,15.85 7.4,15.85 7.6,15.61 8.2,15.61 8.54,15.27 v8.89,15.27
  Bottom 0.127: R9.1 22.12,11 22.1,10.99 21.64,11 v21.63,10.98 21.5,10.99 20.76,11.75 20.2,12.36 20.2,13.16 19.68,13.83 19.45,14.04 19.47,14.12 19.46,15.21 8.94,15.21 v8.89,15.27
N$1  (via drill 0.25 pad 0.66)
  Top 0.127: v27.22,8.31 27.22,8.84 27.48,9.1 PROC.56
  Bottom 0.127: v27.22,8.31 C27.1
N$2  (via drill 0.25 pad 0.66)
  Top 0.127: v29.26,15.16 29.92,14.86 29.92,13.96 29.77,13.82 24.16,13.82 23.9,14.09 PROC.6
  Bottom 0.127: v29.26,15.16 29.5,15.2 U5.1
N$3  (via drill 0.25 pad 0.66)
  Top 0.127: v13.79,4.72 13.79,4.93 13.79,4.97 LED3.C
  Bottom 0.127: v13.79,4.72 13.51,4.73 R12.1
N$6
  Top 0.127: PROC.29 15.95,7.1 LED3.A
N$7  (via drill 0.25 pad 0.66)
  Top 0.127: v11.89,7.01 12.03,7.15 LED2.C
  Bottom 0.127: v11.89,7.01 12.03,6.89 R14.1
N$8  (via drill 0.25 pad 0.66)
  Top 0.127: v12.88,9.15 13.24,8.81 LED1.C
  Bottom 0.127: v12.88,9.15 12.71,8.98 R15.1
N$9
  Top 0.127: PROC.28 15.43,7.6 LED2.A
N$11
  Top 0.127: LED1.A 15,8.1 15.97,8.1 PROC.27
N$21
  Top 0.127: PROC.17 16,13.09 16,17.11 15.8,17.37 10.6,17.37 10.33,17.71 10.33,19.51 9.96,19.85 JP3.1
N$23  (via drill 0.25 pad 0.66)
  Top 0.127: v5.88,8.74 5.89,8.27 6.29,8.1 6.15,8.16 7.13,7.73 8.25,7.27 U4.29
  Bottom 0.127: v5.88,8.74 5.97,8.73 6.47,8.49 C4.1
N$24
  Top 0.127: PROC.18 15.72,12.6 15.68,12.87 15.68,16.88 15.43,17.12 10.42,17.12 10.06,17.51 10.06,18.51 9.84,18.8 8.6,18.81 8,19.31 8,19.77 JP3.2
N$28  (via drill 0.25 pad 0.66)
  Top 0.127: U4.13 8.76,1.11 9,1.11 | 9,1.11 9.26,1.11 U4.14 | 9,1.11 9,0.85 9,0.7 10.99,0.7 13.5,0.71 v13.65,1
  Bottom 0.127: v13.65,1 12.88,1.01 10.98,1.01 9.03,2.96 8.79,2.95 C6.1
N$29  (via drill 0.25 pad 0.66)
  Top 0.127: v6.9,15.29 7.32,15.29 7.6,15.01 7.9,15.01 8.08,14.81 U3.20
  Bottom 0.127: v6.9,15.29 6.9,15.22 7.06,15.05 7.37,15.05 C7.2
N$32  (via drill 0.25 pad 0.66)
  Top 0.127: v7.72,9.37 7.58,9.38 U3.10
  Bottom 0.127: v7.72,9.37 7.51,9.46 C9.1
N$42  (via drill 0.25 pad 0.66)
  Top 0.127: v29.36,14.36 29.23,14.08 24.9,14.08 PROC.4
  Bottom 0.127: v29.36,14.36 29.5,14.36 U5.2
N$43  (via drill 0.25 pad 0.66)
  Top 0.254: v2.53,4.52 1.97,4.06 BALUN.4
  Bottom 0.254: v2.53,4.52 2.84,4.53 3.14,4.28 C19.1
N$45  (via drill 0.25 pad 0.66)
  Top 0.127: v24.86,16.37 24.71,16.18 24.66,16.15 24.75,16.21 24.41,16.01 PROC.5
  Bottom 0.127: v24.86,16.37 22.35,16.37 22.13,16.18 22.11,16.16 22.11,16.17 U5.8
N$46  (via drill 0.25 pad 0.66)
  Top 0.254: v2.98,2.28 2.77,2.24 BALUN.3
  Bottom 0.254: v2.98,2.28 3.09,2.29 3.45,1.85 C20.1
N$47  (via drill 0.25 pad 0.66)
  Top 0.254: v5,4.67 5.37,4.51 U4.4
  Bottom 0.254: v5,4.67 4.72,4.65 4.48,4.25 C19.2
N$48  (via drill 0.25 pad 0.66)
  Top 0.127: v24.82,10.93 23.16,11 22.9,11.27 PROC.8
  Bottom 0.127: v24.82,10.93 27.87,10.93 28.2,11.21 U5.4
N$49  (via drill 0.25 pad 0.66)
  Top 0.254: v5.15,2.69 5.15,3.68 5.55,3.96 U4.5
  Bottom 0.254: v5.15,2.69 5.14,1.59 C20.2
N$50  (via drill 0.25 pad 0.66)
  Top 0.127: 10.88,9.63 10.88,7.39 10.59,7.11 U4.25 | 10.88,9.63 11.58,9.16 U10.3 | 10.88,9.63 v10.06,10.2
  Bottom 0.127: v10.06,10.2 10.08,9.98 10.08,9.58 C22.1
N$51  (via drill 0.25 pad 0.66)
  Top 0.127: U4.26 9.76,7.52 9.86,7.72 9.7,7.79 v9.11,8.42 9.76,7.74 U10.1
  Bottom 0.127: v9.11,8.42 9.64,7.82 C21.1
N$52
  Top 0.254: U11.P$1 0.67,1.82 BALUN.1 0.47,2.24 0.1,2.61 0.1,4.91 U12.SIG
N$57  (via drill 0.25 pad 0.66)
  Top 0.127: v32.73,1 32.73,0.47 32.47,0.21 | 32.47,0.21 | 32.47,0.21 26.66,0.21 26.39,0.47 JP4.1
  Bottom 0.127: C13.1 25.56,0.73 27.28,0.73 | v32.73,1 32.46,0.73 27.28,0.73 | 27.28,0.73 R10.1
OSC1  (via drill 0.25 pad 0.66)
  Top 0.127: v33.97,19.31 34.09,19.71 34.09,20.05 34.09,21.66 U6.3 | v32.91,1.89 32.15,1.89 31.89,1.63 31.89,0.48 27.39,0.48 JP4.2 | v21.66,1.47 21.9,1.7 PROC.39 | v32.67,5.38 32.67,5.83 32.7,5.86 33,6.17 33,9.51 32.64,9.79 JP2.12
  Bottom 0.127: v33.97,19.31 33.97,5.74 33.78,5.55 33.78,5.38 | 33.78,5.38 33.78,2.19 33.53,1.9 33.52,1.89 v32.91,1.89 33.49,1.35 33.49,0.74 33.46,0.71 33.25,0.47 22.58,0.47 v21.66,1.47 | 33.78,5.38 v32.67,5.38
OSC2
  Top 0.127: PROC.40 22.38,1.23 22.09,0.94 17.41,0.94 JP9.2
PWM1H  (via drill 0.25)
  Top 0.127: PROC.61 29.19,11.6 v29.9,12.2 | v29.3,16.61 29.1,16.81 29.1,19.41 28.9,19.61 26.7,19.61 26,20.31 26,21.96 U$1.7
  Bottom 0.127: v29.9,12.2 29.9,12.55 29.8,12.71 29.8,13.81 29.9,13.91 29.9,16.11 v29.3,16.61
PWM1L  (via drill 0.25)
  Top 0.127: PROC.60 29.49,11.1 v30.03,11.4 | v29.9,17.41 29.9,18.81 29.6,19.11 29.6,19.61 29.2,20.01 27.5,20.01 27,20.51 27,21.96 U$1.5
  Bottom 0.127: v30.03,11.4 30.44,11.9 30.44,12.44 30.08,12.76 30.08,13.41 30.2,13.51 30.2,16.31 v29.9,17.41
PWM2H
  Top 0.127: PROC.63 29.17,12.62 29.38,12.83 29.4,13.11 29.51,13.24 30.02,13.23 30.5,13.7 30.5,18.91 29.97,19.41 29.97,20.21 29.6,20.51 28.5,20.51 28,21.01 28,22 U$1.3
PWM2L  (via drill 0.25)
  Top 0.127: PROC.62 29.09,12.1 29.1,12.11 29.2,12.11 29.38,12.3 29.38,12.4 29.74,12.84 30.4,12.81 v30.62,13.05 | v31.06,17.29 31.06,18.89 30.3,19.61 30.3,21.31 30.1,21.51 29.49,21.51 U$1.1
  Bottom 0.127: v30.62,13.05 30.62,13.45 30.5,13.71 30.5,16.41 30.96,16.97 v31.06,17.29
PWM3H
  Top 0.127: PROC.1 26.4,16.01 26.4,16.21 26.6,16.41 27.3,16.41 27.4,16.51 27.4,17.98 U$1.4
PWM3L
  Top 0.127: U$1.2 28.48,16.73 28.6,16.61 28.6,16.11 30.2,15.34 30.2,13.79 29.92,13.54 29.32,13.54 29,13.11 PROC.64
PWM4H
  Top 0.127: PROC.3 25.4,17.98 U$1.8
PWM4L
  Top 0.127: PROC.2 25.9,16.41 26.5,17.01 26.5,18.05 U$1.6
RB15  (via drill 0.25 pad 0.66)
  Top 0.127: v18.33,6.23 17.94,6.6 PROC.30 | v6.16,1.05 7.75,1.05 U4.11
  Bottom 0.127: v6.16,1.05 6.89,0.47 18.06,0.47 19.25,0.48 19.43,0.67 19.4,3.71 18.84,4.27 18.84,4.69 18.25,5.21 18.26,5.68 18.34,5.76 v18.33,6.23
RC13  (via drill 0.25 pad 0.66)
  Top 0.127: v25.9,6.88 | PROC.47 v25.9,6.88 | v29.89,10.6 30.16,10.6 30.6,11.25 30.61,11.44 30.61,11.69 30.86,11.95 30.86,12.46 31.05,12.73 JP2.18
  Bottom 0.127: v29.89,10.6 29.73,10.58 29.73,10.09 29.57,9.86 29.18,9.34 26.16,9.32 25.9,9.06 v25.9,6.88
RC14  (via drill 0.25 pad 0.66)
  Top 0.127: v27.63,3.9 27.62,3.9 27.39,3.54 26.42,3.54 PROC.48 | v32.74,3.22 33,3.48 33.43,3.48 33.69,3.74 33.77,3.82 33.77,12.1 33.43,12.29 JP2.17
  Bottom 0.127: v32.74,3.22 33.17,3.65 33.17,4.28 32.91,4.54 28.27,4.54 v27.63,3.9
RD0  (via drill 0.25 pad 0.66)
  Top 0.127: v32.18,2.66 32.11,2.73 32.11,6.79 JP2.6 | v25.36,5.39 25.4,5.37 PROC.46
  Bottom 0.127: v25.36,5.39 28.02,5.39 28.57,4.84 | 28.57,4.84 | 28.57,4.84 33.17,4.84 33.43,4.58 | 33.43,4.58 | 33.43,4.58 33.43,2.92 33.17,2.66 v32.18,2.66
RD1
  Top 0.127: PROC.49 29.81,5.6 29.99,5.79 JP2.4
RD2
  Top 0.127: PROC.50 27.5,6.1 27.5,5.29 27.75,5.15 27.76,5.15 29.25,5.15 29.51,5.29 JP2.3
RD3
  Top 0.127: PROC.51 29.75,6.6 30.07,6.29 JP2.5
RD4
  Top 0.127: JP2.7 30.53,7.29 30.35,7.1 PROC.52
RD5
  Top 0.127: JP2.9 31.03,8.27 30.38,7.6 PROC.53
RD6
  Top 0.127: JP2.11 31.13,9.26 30.84,8.96 30.84,8.67 30.34,8.12 PROC.54
RD7
  Top 0.127: JP2.13 31.1,10.23 30.93,10 30.92,9.66 30.21,8.6 PROC.55
RF0
  Top 0.127: PROC.58 28.81,10.1 28.9,10.11 28.93,10.04 30.11,10.03 30.12,10.03 30.3,10.21 30.89,11.1 30.89,11.53 30.89,11.6 30.99,11.69 JP2.16
RF1  (via drill 0.25 pad 0.66)
  Top 0.127: v25.36,8.53 26.14,9.3 26.14,10.34 26.4,10.6 PROC.59 | v32.46,7.79 32.38,7.79 JP2.8
  Bottom 0.127: v32.46,7.79 32.47,6.55 32.12,6.19 25.63,6.19 25.36,6.45 | 25.36,6.45 | 25.36,6.45 v25.36,8.53
SCK1
  Top 0.127: U4.19 11.75,3.36 12.57,2.77 16.04,2.77 16.55,3.39 18.01,3.39 18.26,3.14 18.26,2.5 18.5,2.35 19.59,2.35 19.62,2.38 19.9,2.61 PROC.35
SCL1  (via drill 0.25 pad 0.66)
  Top 0.127: v24.14,6.36 24.1,6.4 21.16,6.4 20.9,6.13 PROC.37 | v33.44,14.08 33.03,14.09 32.8,13.79 JP2.20 | v14.76,9.34 14.49,9.34 13.3,10.26 U8.14 | v19.37,8.8 19.69,8.8 20,9.14 22.33,9.13 22.65,8.88 v24.15,8.88
  Bottom 0.127: v24.14,6.36 24.14,5.66 24.4,5.39 24.75,5.39 24.75,3.29 R5.1 | v24.14,6.36 24.68,6.36 25.11,5.93 33.18,5.93 33.44,6.19 v33.44,14.08 | v14.76,9.34 15.48,8.54 19.14,8.53 v19.37,8.8 | v24.15,8.88 v24.14,6.36
SCL2  (via drill 0.25 pad 0.66)
  Top 0.127: U3.23 6.08,15.54 4.25,15.54 4.14,15.44 v4.14,7.38 | v18.16,7.46 18.47,7.46 18.76,7.76 19.94,7.76 20.21,8.03 21.71,8.03 21.89,8.15 22.97,8.15 22.99,8.14 v23.11,7.99 | v15.58,6.15 15.58,5.87 15.97,5.6 PROC.32 | v28.68,2.84 29.39,2.84 JP4.4
  Bottom 0.127: v4.14,7.38 4.64,6.86 10.14,6.86 10.55,6.55 10.56,3.72 11.56,2.88 14.66,2.88 14.9,3.22 14.89,4.46 15.25,4.86 15.26,5.28 15.57,5.59 v15.58,6.15 15.58,6.38 16.17,6.85 16.85,7.46 v18.16,7.46 | v4.14,7.38 | 24.23,3.83 24.49,4.09 24.49,5.13 23.37,5.13 23.11,5.39 v23.11,7.99 | 24.23,3.83 20.64,3.83 R8.1 | 24.23,3.83 24.49,3.83 24.49,3 24.75,2.74 | 24.75,2.74 | 24.75,2.74 28.58,2.74 v28.68,2.84
SDA1  (via drill 0.25 pad 0.66)
  Top 0.127: v34.31,5.1 34.31,14.52 34.05,14.79 JP2.22 | PROC.36 20.4,2.38 20.4,2.25 v20.4,2.08 18.38,2.09 17.97,2.39 17.97,2.62 v17.66,2.85 | v15.79,4.21 15.29,4.57 14.57,5.26 14.16,5.26 13.87,5.46 13.87,6.48 14,6.61 13.98,9.05 13.02,9.83 12.16,9.83 11.4,10.49 11.4,10.97 U8.13
  Bottom 0.127: v34.31,5.1 34.31,0.47 34.05,0.21 22.01,0.21 20.6,1.51 20.39,1.72 v20.4,2.08 21.03,2.08 20.91,2.08 23.58,2.08 23.85,2.39 R6.1 | v17.66,2.85 17.68,4.55 17.36,5.01 16.7,5.01 16.14,4.21 v15.79,4.21
SDA2  (via drill 0.25 pad 0.66)
  Top 0.127: JP4.3 28.16,1.58 28.16,4.23 27.98,4.43 26.78,4.43 26.43,4.76 26.43,7.16 26.18,7.43 22.93,7.43 22.82,7.5 19.38,7.5 19.05,6.98 19.04,5.78 v18.84,5.52 18.14,5.52 17.89,5.78 17.57,6.1 PROC.31 | v4.67,14.71 5.78,14.71 5.79,14.69 U3.24
  Bottom 0.127: 19.81,2.61 19.81,0.57 19.65,0.21 6.31,0.21 5.82,0.22 5.48,0.37 5.32,0.37 5.16,0.37 4.36,0.37 4.14,0.59 4.1,2.41 3.9,2.81 3.85,4.06 3.85,4.96 3.27,5.57 3.27,8.83 3,9.21 3.01,13.35 4.46,14.7 v4.67,14.71 | 19.81,2.61 21.94,2.61 R7.1 | v18.84,5.52 19.1,5.22 19.1,4.51 19.8,3.91 19.81,2.61
SDI1
  Top 0.127: PROC.34 19.41,2.71 19.27,2.61 18.69,2.61 18.54,2.7 18.54,3.49 18.31,3.65 16.41,3.65 15.92,3.04 12.69,3.04 11.65,3.86 11.49,3.96 U4.20
SDO1
  Top 0.127: PROC.33 18.85,3.85 18.83,3.94 17.97,3.94 16.31,3.94 15.75,3.33 13.58,3.33 13.25,3.67 13.25,4.06 12.35,4.96 U4.22
SS1  (via drill 0.25 pad 0.66)
  Top 0.127: v13.83,3.89 13.81,3.89 13.61,4.1 13.14,4.58 12.44,5.38 11.34,5.38 11.01,5.38 U4.23 | v18.14,10.51 18.27,10.62 19.83,12.3 19.83,14.1 19.89,14.16 PROC.14
  Bottom 0.127: v18.14,10.51 16.69,10.51 16.17,9.86 14.42,9.88 14.16,9.62 14.16,9.15 14.7,8.61 14.71,5.07 14.33,4.69 14.32,4.27 v13.83,3.89
VCC  (via drill 0.25, 0.25 pad 0.66)
  Top 0.127: v17.3,17.71 11.15,17.71 v10.86,17.9
  Top 0.178: v30.06,9.46 30.06,9.57 30.2,9.71 30.5,9.71 30.6,9.81 30.58,10.05 30.8,10.41 30.91,10.61 JP2.14 | v32.45,16.82 32.22,16.63 32.03,16.56 31.65,16.57 v31.36,16.44 31.2,16.35 30.86,16.01 30.84,14.48 31.01,14.3 JP2.21 | U2.6 11.14,20.93 10.87,20.53 10.87,17.99 v10.86,17.9
  Bottom 0.178: v17.3,17.71 18.52,17.63 18.82,17.63 18.78,17.62 21.63,17.6 21.93,17.6 23.26,18.87 30.77,18.85 31.37,18.55 31.89,18.57 32.19,18.27 32.3,18.17 32.64,17.81 32.64,17.07 v32.45,16.82 | v30.06,9.46 30.35,9.15 31.11,9.15 31.5,9.54 C1.2 30.82,13.95 30.82,15.91 31.2,16.35 v31.36,16.44 | C17.1 10.95,18.24 v10.86,17.9
VDD  (via drill 0.25, 0.25 pad 0.66)
  Top 0.254: v5.25,10.14 5.25,9.57 5.66,9.57 6.58,9.57 6.58,8.76 | 6.58,8.76 6.58,9.83 U3.8 | v12.75,16.18 12.17,16.23 11.97,15.63 11.24,15.63 10.25,14.7 10.25,13.13 10.15,13.01 v10.15,12.39 10.15,11.4 9.89,11.14 U3.13 | v18.89,1.49 20.01,1.48 20.3,1.28 20.64,1.28 21.4,2.18 PROC.38 | U8.1 15.37,10.97 15.37,8.87 15.63,8.6 PROC.26 17.64,8.61 18.12,8.1 19.64,8.1 20.24,8.58 v21.52,8.58 | v20.99,13.02 21.9,13.07 PROC.10 | U4.28 8.76,7.46 7.16,8.13 6.94,8.23 6.58,8.43 6.58,8.76 | PROC.19 17.91,12.11 17.9,13.35 v17.63,13.81 17.22,14.53 17.2,15.98 v16.74,16.9 | v13.99,1.74 13.94,1.72 13.3,1.72 12.95,1.03 10.67,1.04 9.76,1.04 U4.15 | JP4.6 31.32,1.58 31.32,3.31 v31.25,3.37 30.98,3.37 30.78,3.57 v29.55,3.57 29.54,4.5 29.27,4.79 27.08,4.79 26.83,5.02 26.83,7.46 26.34,7.95 26.34,8.76 v27.24,9.9 27.61,9.61 28.45,9.61 PROC.57 | v12.75,16.18 13.23,15.96 13.23,15.07 U8.7 | v6.07,1.83 6.03,1.95 U4.8 | v31.57,19.32 31.57,19.59 31.36,19.71 30.97,19.71 30.8,19.91 30.8,21.43 U6.4 | v12.75,16.18 12.88,16.19 | v17.8,16.91 18.32,17.46 18.32,17.83 18.4,17.91 v18.77,18.2 | JP3.4 5.9,19.82 5.9,18.81 6.44,18.27 | 6.44,18.27 U1.6 | 6.44,18.27 5.74,18.27 v5.6,18.31 4.63,17.34 v4.63,16.92
  Bottom 0.127: v5.25,10.14
  Bottom 0.254: 9.39,5.66 9.62,5.37 9.62,2.94 10.88,1.73 v13.99,1.74 14.58,1.09 14.96,1.1 18.33,1.1 18.65,1.29 v18.89,1.49 18.9,3.55 18.5,4.01 18.49,4.43 17.86,4.99 17.86,5.25 17.66,5.41 17.66,6.41 17.99,6.84 18.72,6.85 19.45,5.91 19.46,4.76 19.64,4.5 R8.2 R7.2 22.58,4.5 22.58,4.58 22.84,4.84 | 9.39,5.66 7.43,5.64 C5.1 6.79,3.76 6.79,2.22 6.51,1.97 6.26,1.84 v6.07,1.83 | 9.39,5.66 C3.1 | 22.84,4.84 23.1,4.59 R6.2 | v27.24,9.9 26.67,9.89 24.52,9.89 24.04,9.9 24.03,10.69 24.04,10.95 24.02,11.01 22.87,11.02 22.37,12.1 22.4,12.1 U5.5 21.06,12.11 v20.99,13.02 | R5.2 26.18,4.59 27.15,3.17 27.88,3.17 28.26,3.55 v29.55,3.57 29.54,1.76 29.27,1.49 R10.2 | v17.63,13.81 17.62,12.47 C14.1 13.73,12.26 13.78,12.49 17.57,12.48 19.25,10.91 19.24,10.91 19.26,10.9 21.53,8.91 v21.52,8.58 | v27.24,9.9 28.98,9.9 29.27,10.24 29.25,12.68 U5.3 | v20.99,13.02 20.8,13.06 20.6,13.26 20.07,14.04 20.1,16.9 20.05,16.92 v17.8,16.91 v16.74,16.9 16.35,16.52 14,16.51 13.72,16.23 v12.75,16.18 | v10.15,12.39 9.63,12.92 C8.1 8.05,11.72 8.02,11.69 C10.1 7.98,11.06 6.98,11.06 6.84,10.73 6.83,9.6 5.69,9.6 v5.25,10.14 5.25,15.15 4.9,15.41 4.9,16.11 4.7,16.51 4.7,16.85 v4.63,16.92 | v31.25,3.37 31.25,2.54 31.66,2.13 C18.1 | v20.99,13.02 21.1,13.1 22.4,13.1 U5.6 | 22.84,4.84 22.58,5.1 22.59,6.76 22.6,7.19 22.43,7.55 22.43,8.38 R9.2 24.02,9.88 24.59,9.89 24.86,9.89 v27.24,9.9 | 22.84,4.84 | v31.57,19.32 31.12,19.32 31.01,19.41 22,19.41 20.93,18.34 C23.1 18.88,18.19 v18.77,18.2 | v5.6,18.31 5.96,18.81 C25.1
VEE  (via drill 0.25 pad 0.66)
  Top 0.178: v32.91,11.29 JP2.15 | v14.86,18.86 13.49,20.35 13.49,20.82 13.04,21.47 12.18,21.47 U2.5
  Bottom 0.178: v32.91,11.29 32.91,12.45 33.05,12.64 33.05,13.55 32.84,13.74 32.84,14.49 33.62,15.21 33.62,17.72 33.59,17.88 33.46,18.05 33.28,18.23 33.27,18.51 32.68,18.78 32.57,18.89 32.58,19.14 31.84,19.92 18.9,19.91 17.95,18.86 15.67,18.86 15.33,18.86 v14.86,18.86 13.19,18.86 C16.1
VPP  (via drill 0.25, 0.25 pad 0.66)
  Top 0.178: v14.66,15.75 14.6,15.68 14.6,14.97 U8.6 | v16.62,13.82 v16.59,15.75 | U1.5 6.94,18.65 7,18.74 8.1,18.73 v8.89,17.97 8.99,17.48 9.8,16.51 10.1,16.51 v10.4,16.21
  Bottom 0.178: C29.2 13.08,10.89 13.12,13.56 C28.1 15.98,13.54 v16.62,13.82 | v16.59,15.75 v14.66,15.75 13.83,15.75 13.56,15.53 11.03,15.52 10.54,16.21 v10.4,16.21 | C26.1 8.88,18.79 v8.89,17.97

### Text on the board
tPlace: GND | MCLR | VDD | AN7 | AN6 | GND | BAT+ | AN10 | OSC2 | OSC1 | SDA2 | SCL2 | GND | VDD
bPlace: UC Berkeley | CrawlerProc 1.0
tNames: U2 | U1
bDocu: GYRO | XL | RADIO | LED | I2C2 | I2C1 | WII